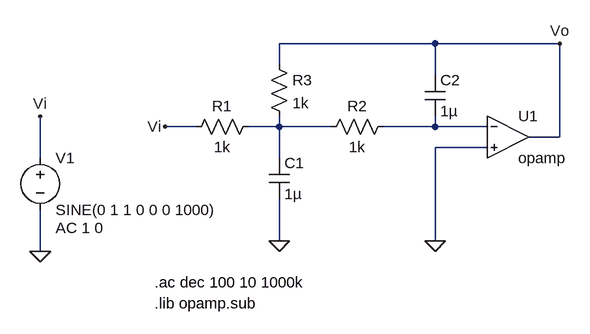
[diagram p0: schematic mfb_lp.asc]
mfb_lp.asc, the LTspice schematic file:
Version 4
SHEET 1 880 680
WIRE 352 64 112 64
WIRE 544 64 352 64
WIRE 112 96 112 64
WIRE 352 112 352 64
WIRE -16 192 -64 192
WIRE 112 192 112 176
WIRE 112 192 64 192
WIRE 192 192 112 192
WIRE 352 192 352 176
WIRE 352 192 272 192
WIRE 432 192 352 192
WIRE 544 208 544 64
WIRE 544 208 496 208
WIRE 432 224 352 224
WIRE -256 240 -256 176
WIRE 112 240 112 192
WIRE 112 368 112 304
WIRE 352 368 352 224
WIRE -256 384 -256 320
FLAG 112 368 0
FLAG 352 368 0
FLAG -64 192 Vi
FLAG 544 64 Vo
FLAG -256 384 0
FLAG -256 176 Vi
SYMBOL res 80 176 R90
WINDOW 0 0 56 VBottom 2
WINDOW 3 32 56 VTop 2
SYMATTR InstName R1
SYMATTR Value 1k
SYMBOL res 288 176 R90
WINDOW 0 0 56 VBottom 2
WINDOW 3 32 56 VTop 2
SYMATTR InstName R2
SYMATTR Value 1k
SYMBOL cap 96 240 R0
SYMATTR InstName C1
SYMATTR Value 1µ
SYMBOL cap 336 112 R0
SYMATTR InstName C2
SYMATTR Value 1µ
SYMBOL res 96 80 R0
SYMATTR InstName R3
SYMATTR Value 1k
SYMBOL Opamps\\opamp 464 144 R0
SYMATTR InstName U1
SYMATTR SpiceLine Aol=1000K
SYMATTR SpiceLine2 GBW=100Meg
SYMBOL voltage -256 224 R0
WINDOW 123 24 124 Left 2
WINDOW 39 0 0 Left 0
SYMATTR InstName V1
SYMATTR Value SINE(0 1 1 0 0 0 1000)
SYMATTR Value2 AC 1 0
TEXT -80 432 Left 2 !.ac dec 100 10 1000k
TEXT -80 464 Left 2 !.lib opamp.sub

The netlist it stands for:
* mfb_lp.asc
R1 N001 Vi 1k
R2 N002 N001 1k
C1 N001 0 1µ
C2 Vo N002 1µ
R3 Vo N001 1k
XU1 N002 0 Vo opamp Aol=1000K GBW=100Meg  ; pins invin noninvin out
V1 Vi 0 SINE(0 1 1 0 0 0 1000) AC 1 0
.ac dec 100 10 1000k
.lib opamp.sub
.backanno
.end